# Altium schematic sheet Sheet1.SchDoc
size A3; SheetNumber: 1; SheetTotal: 1
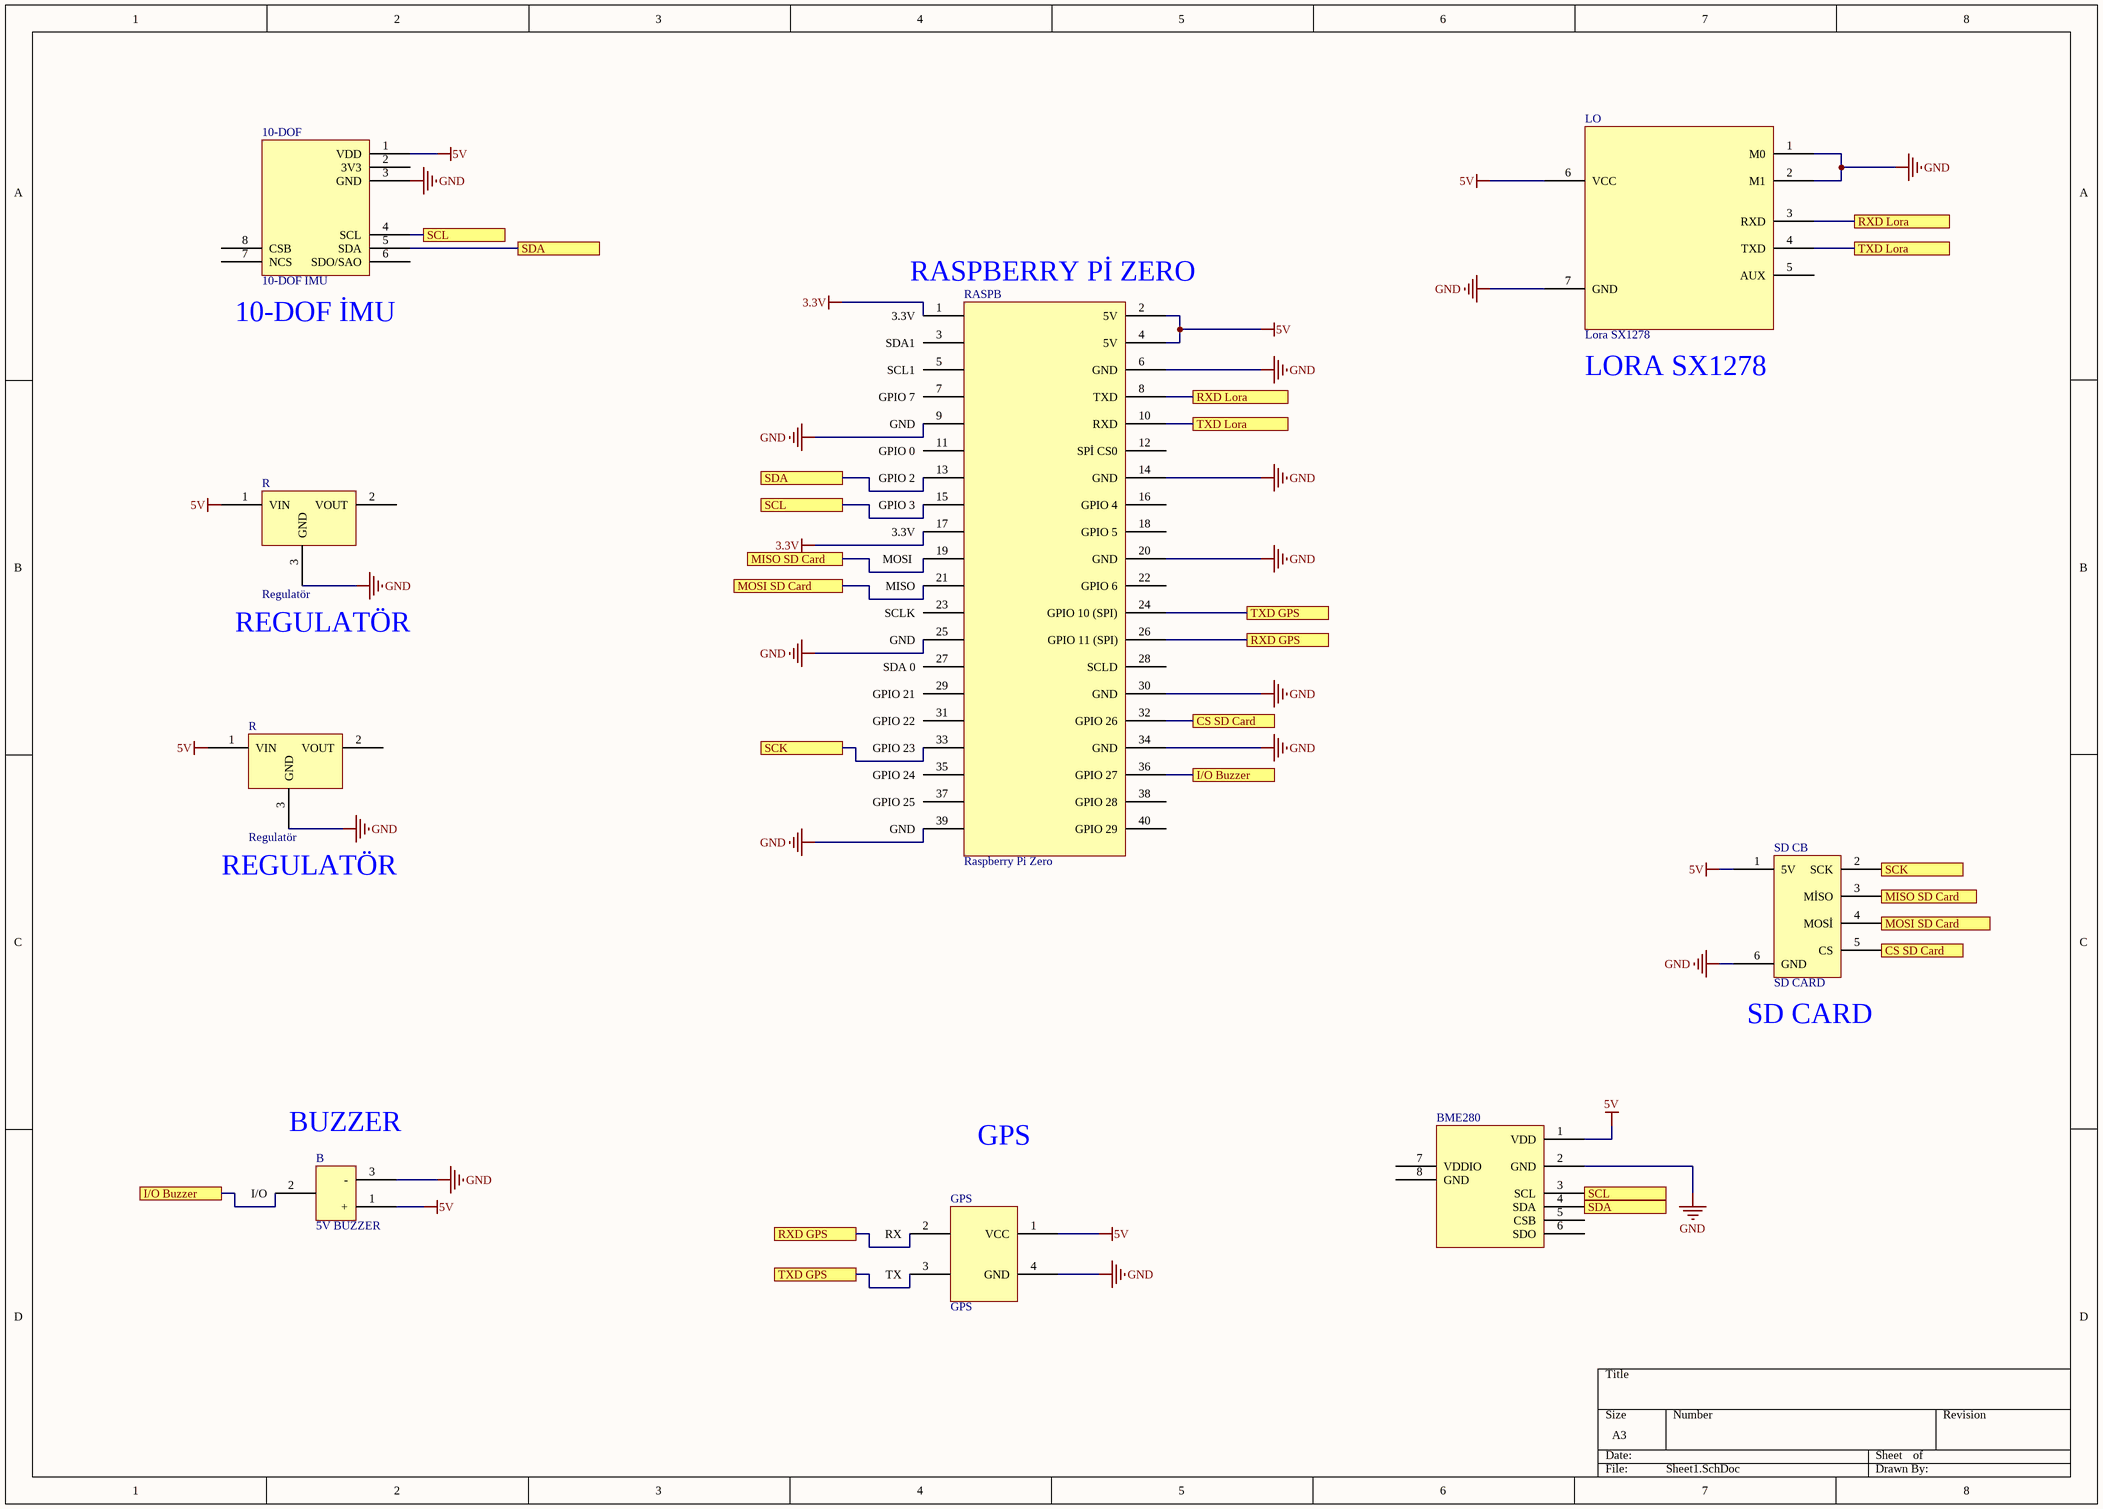
[diagram p0: Sheet1.SchDoc]

## Parts
(Parts that share a designator on the sheet are numbered #1, #2 ... from top to bottom, then left to right.)
10-DOF  10-DOF IMU  [10-DOF IMU]
B  5V BUZZER
BME280  BME280  [BME280]  (value not drawn)
GPS  GPS  [GPS]
LO  Lora SX1278  [Lora SX1278]
R#1  Regulatör  [5V REGULATOR LM2596]
R#2  Regulatör  [5V REGULATOR LM2596]
RASPB  Raspberry Pi Zero  [Raspberry Pi Zero]
SD_C  SD CARD  [SD CARD]  (part B of 2)

## Ports
CS SD Card, I/O Buzzer, MISO SD Card, MOSI SD Card, RXD GPS, RXD Lora, SCK, SCL, SDA, TXD GPS, TXD Lora

## Nets
5V: 10-DOF.1(VDD) B.1(+) BME280.1(VDD) GPS.1(VCC) LO.6(VCC) R#1.1(VIN) R#2.1(VIN) RASPB.2(5V) RASPB.4(5V) SD_C.1(5V)
GND: 10-DOF.3(GND) B.3(-) BME280.2(GND) GPS.4(GND) LO.1(M0) LO.2(M1) LO.7(GND) R#1.3(GND) R#2.3(GND) RASPB.6(GND) RASPB.14(GND) RASPB.20(GND) RASPB.30(GND) RASPB.34(GND) SD_C.6(GND)
CS SD Card: RASPB.32(GPIO_26) SD_C.5(CS) ; port CS SD Card
I/O Buzzer: RASPB.36(GPIO_27) ; port I/O Buzzer
MISO SD Card: SD_C.3(MİSO) ; port MISO SD Card
MOSI SD Card: SD_C.4(MOSİ) ; port MOSI SD Card
RXD GPS: RASPB.26(GPIO_11_(SPI)) ; port RXD GPS
RXD Lora: LO.3(RXD) RASPB.8(TXD) ; port RXD Lora
SCK: SD_C.2(SCK) ; port SCK
SCL: 10-DOF.4(SCL) BME280.3(SCL) ; port SCL
SDA: 10-DOF.5(SDA) BME280.4(SDA) ; port SDA
TXD GPS: RASPB.24(GPIO_10_(SPI)) ; port TXD GPS
TXD Lora: LO.4(TXD) RASPB.10(RXD) ; port TXD Lora

Not connected (* = marked no-connect by the designer): 10-DOF 2(3V3) 6(SDO/SAO) 7(NCS) 8(CSB); B 2(I/O); BME280 5(CSB) 6(SDO) 7(VDDIO) 8(GND); GPS 2(RX) 3(TX); LO 5(AUX); R#1 2(VOUT); R#2 2(VOUT); RASPB 1(3.3V) 3(SDA1) 5(SCL1) 7(GPIO_7) 9(GND) 11(GPIO_0) 12(SPİ_CS0) 13(GPIO_2) 15(GPIO_3) 16(GPIO_4) 17(3.3V) 18(GPIO_5) 19(MOSI_) 21(MISO) 22(GPIO_6) 23(SCLK) 25(GND) 27(SDA_0) 28(SCLD) 29(GPIO_21) 31(GPIO_22) 33(GPIO_23) 35(GPIO_24) 37(GPIO_25) 38(GPIO_28) 39(GND) 40(GPIO_29)

## Notes on the sheet
- (near RASPB) RASPBERRY Pİ ZERO
- (near 10-DOF) 10-DOF İMU
- LORA SX1278
- REGULATÖR
- (near SD_C) SD CARD
- (near B) BUZZER
- GPS

## Library data of the parts
BME280 = BME 280